# Altium schematic sheet 驰风队20200805.SchDoc
size A2
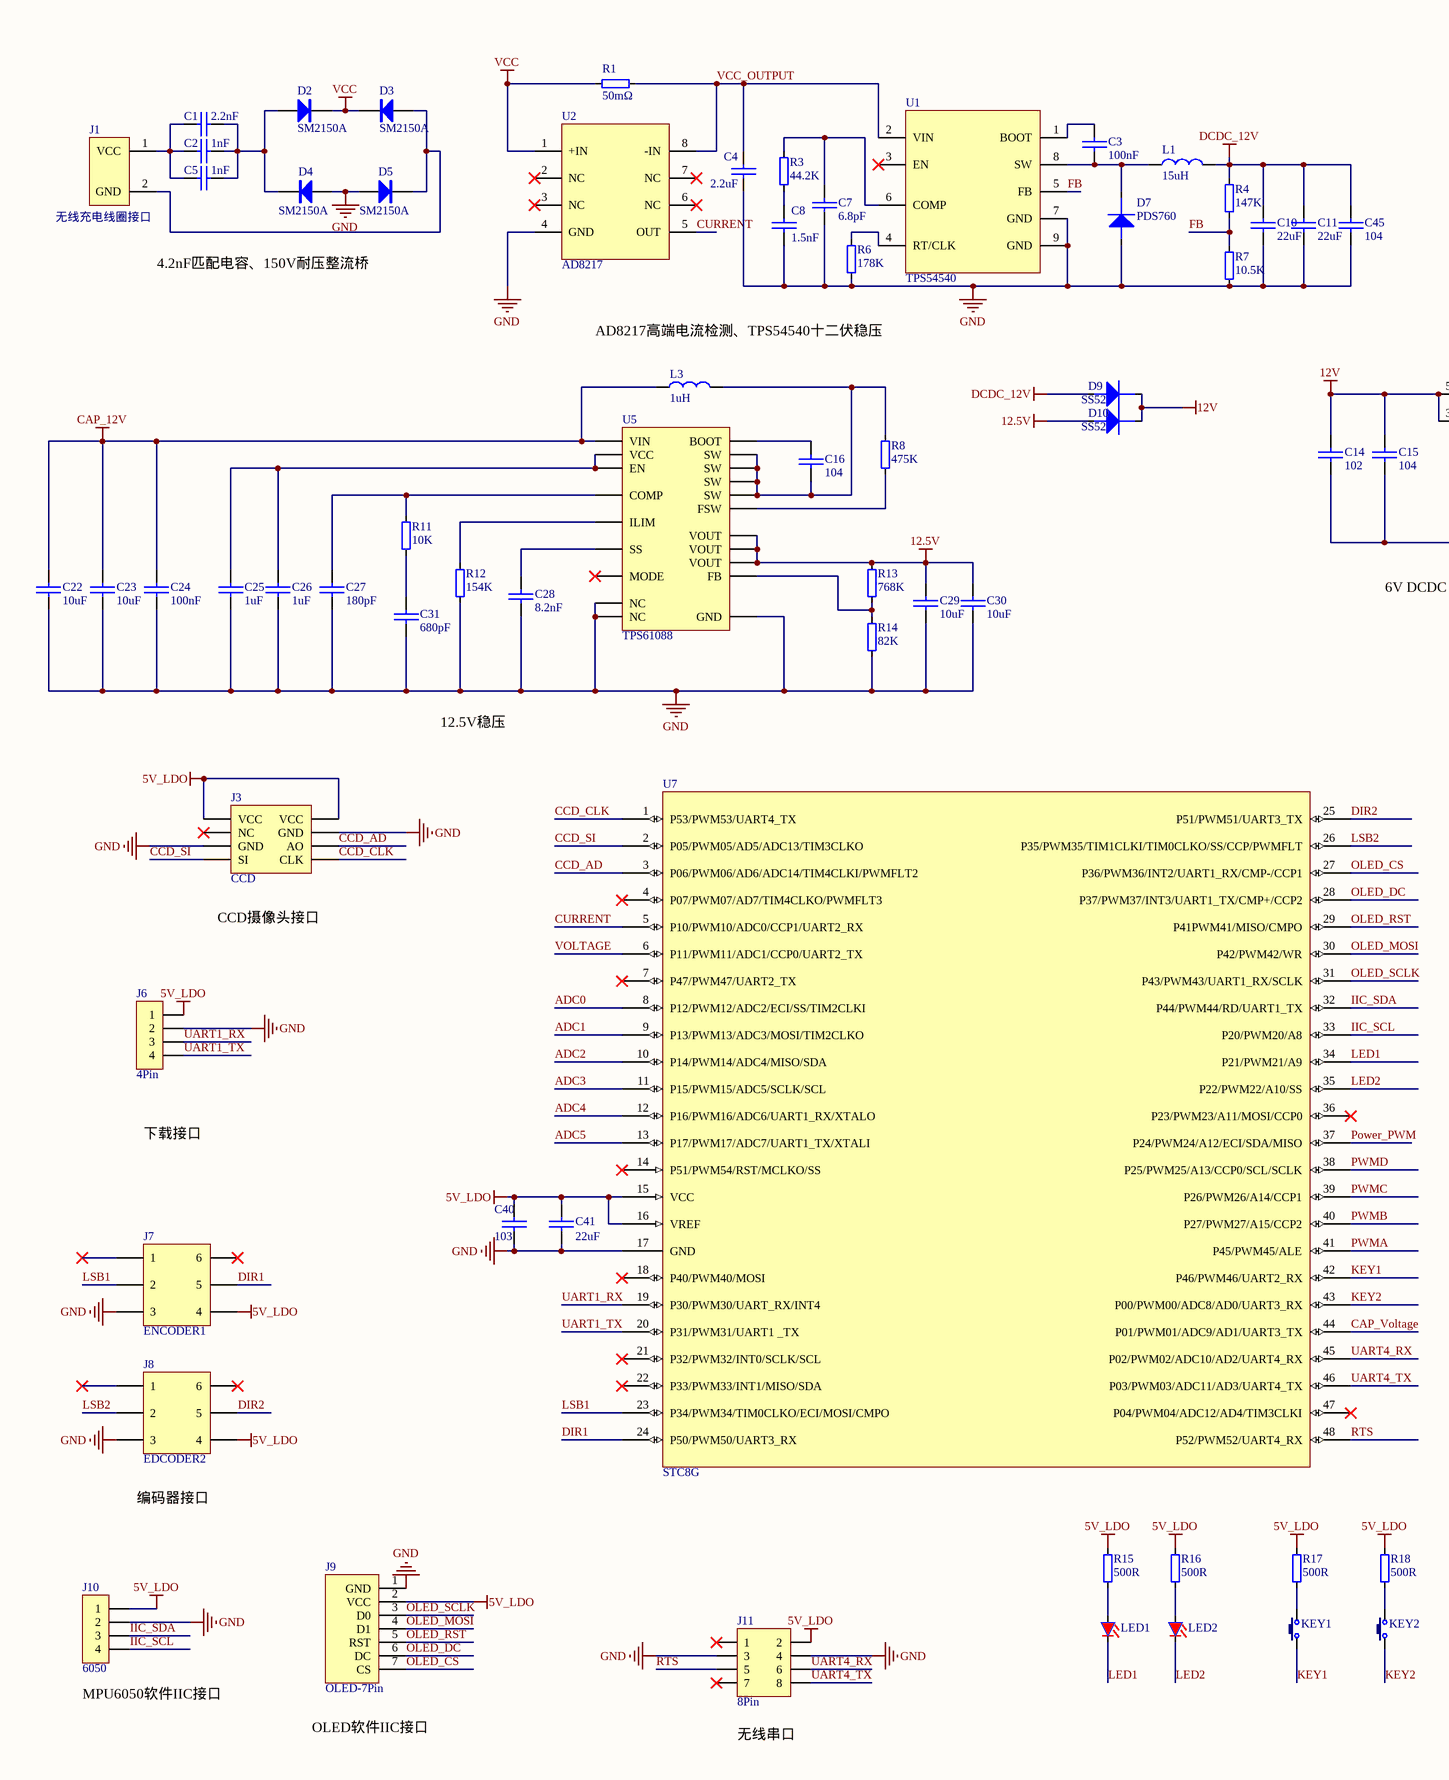
[diagram p0: 驰风队20200805.SchDoc, left]
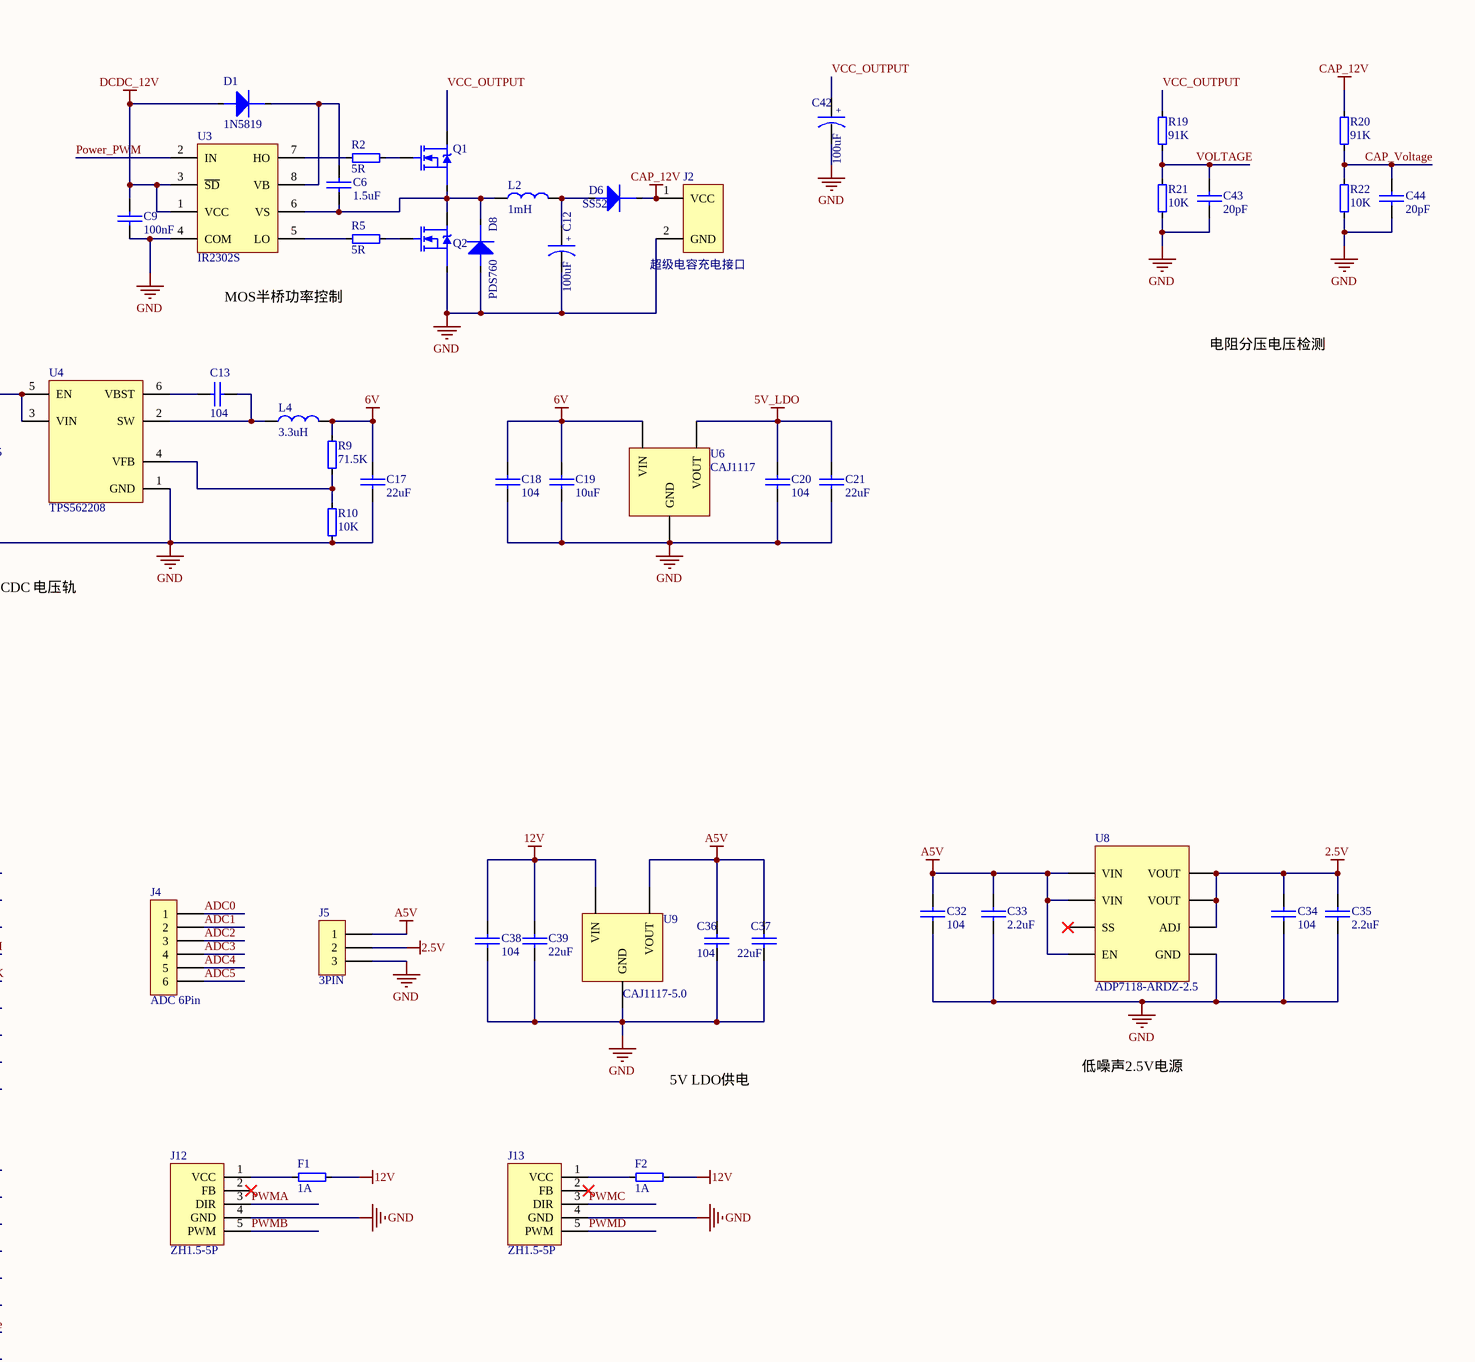
[diagram p1: 驰风队20200805.SchDoc, right]

## Parts
C1  2.2nF  [C1206]
C2  1nF  [C1206]
C3  100nF  [C0603]
C4  2.2uF  [C1206]
C5  1nF  [C1206]
C6  1.5uF  [C0603]
C7  6.8pF  [C0603]
C8  1.5nF  [C0603]
C9  100nF  [C0603]
C10  22uF  [C1206]
C11  22uF  [C1206]
C12  100uF  [CAP 8*9]
C13  104  [C0603]
C14  102  [C0603]
C15  104  [C0603]
C16  104  [C0603]
C17  22uF  [C1206]
C18  104  [C0603]
C19  10uF  [C0603]
C20  104  [C0603]
C21  22uF  [C1206]
C22  10uF  [C0603]
C23  10uF  [C0603]
C24  100nF  [C0603]
C25  1uF  [C0603]
C26  1uF  [C0603]
C27  180pF  [C0603]
C28  8.2nF  [C0603]
C29  10uF  [C0603]
C30  10uF  [C0603]
C31  680pF  [C0603]
C32  104  [C0603]
C33  2.2uF  [C0603]
C34  104  [C0603]
C35  2.2uF  [C0603]
C36  104  [C0603]
C37  22uF  [C1206]
C38  104  [C0603]
C39  22uF  [C1206]
C40  103  [C0603]
C41  22uF  [C1206]
C42  100uF  [CAP 8*9]
C43  20pF  [C0603]
C44  20pF  [C0603]
C45  104  [C0603]
D1  1N5819  [SOD123]
D2  SM2150A  [SMB]
D3  SM2150A  [SMB]
D4  SM2150A  [SMB]
D5  SM2150A  [SMB]
D6  SS52  [SMB]
D7  PDS760  [PDS760]
D8  PDS760  [PDS760]
D9  SS52  [SMB]
D10  SS52  [SMB]
F1  1A  [R0805]
F2  1A  [R0603]
J1  无线充电线圈接口  [2P]
J2  超级电容充电接口  [XT30]
J3  CCD  [8Pin]
J4  ADC 6Pin  [ADC 6Pin]
J5  3PIN  [3PIN]
J6  4Pin  [4Pin]
J7  ENCODER1  [DC3 2*3P]
J8  EDCODER2  [DC3 2*3P]
J9  OLED-7Pin  [OLED-7Pin]
J10  6050  [4Pin]
J11  8Pin  [8Pin]
J12  ZH1.5-5P  [ZH1.5-5P]
J13  ZH1.5-5P  [ZH1.5-5P]
KEY1  KEY  [KEY]  (value not drawn)
KEY2  KEY  [KEY]  (value not drawn)
L1  15uH  [L13.5*12.5]
L2  1mH  [L13.5*12.5]
L3  1uH  [L0630]
L4  3.3uH  [L0630]
LED1  LED  [LED]  (value not drawn)
LED2  LED  [LED]  (value not drawn)
Q1  PSMN3R7-100BSE  [D2PAK]  (value not drawn)
Q2  PSMN3R7-100BSE  [D2PAK]  (value not drawn)
R1  50mΩ  [R2010]
R2  5R  [R0603]
R3  44.2K  [R0603]
R4  147K  [R0603]
R5  5R  [R0603]
R6  178K  [R0603]
R7  10.5K  [R0603]
R8  475K  [R0603]
R9  71.5K  [R0603]
R10  10K  [R0603]
R11  10K  [R0603]
R12  154K  [R0603]
R13  768K  [R0603]
R14  82K  [R0603]
R15  500R  [R0603]
R16  500R  [R0603]
R17  500R  [R0603]
R18  500R  [R0603]
R19  91K  [R0603]
R20  91K  [R0603]
R21  10K  [R0603]
R22  10K  [R0603]
U1  TPS54540  [TPS54540]
U2  AD8217  [AD8217]
U3  IR2302S  [IR2302S]
U4  TPS562208  [TPS562208]
U5  TPS61088  [TPS61088]
U6  CAJ1117  [SOT-89]
U7  STC8G  [LQFP48]
U8  ADP7118-ARDZ-2.5  [SOP8]
U9  CAJ1117-5.0  [SOT-89]

## Nets
2.5V: C34.1 C35.1 J5.2 U8.1(VOUT) U8.2(VOUT) U8.3(ADJ)
5V_LDO: C20.2 C21.2 C40.1 C41.1 J3.1(VCC) J3.2(VCC) J6.1 J7.4 J8.4 J9.2(VCC) J10.1 J11.2 R15.2 R16.2 R17.2 R18.2 U6.2(VOUT) U7.15(VCC) U7.16(VREF)
6V: C17.1 C18.2 C19.2 L4.1 R9.2 U6.3(VIN)
12.5V: C29.1 C30.1 D10.1 R13.2 U5.14(VOUT) U5.15(VOUT) U5.16(VOUT)
12V: C14.1 C15.1 C38.2 C39.1 D9.2 D10.2 F1.2 F2.2 U4.3(VIN) U4.5(EN) U9.3(VIN)
A5V: C32.1 C33.1 C36.2 C37.1 J5.1 U8.5(EN) U8.7(VIN) U8.8(VIN) U9.2(VOUT)
CAP_12V: C22.2 C23.2 C24.2 D6.2 J2.1(VCC) L3.2 R20.2 U5.9(VIN)
DCDC_12V: C9.1 C10.1 C11.1 C45.1 D1.1 D9.1 L1.1 R4.2 U3.1(VCC) U3.3(~{SD})
GND: C4.2 C7.2 C8.2 C9.2 C10.2 C11.2 C12.2 C14.2 C15.2 C17.2 C18.1 C19.1 C20.1 C21.1 C22.1 C23.1 C24.1 C25.1 C26.1 C27.1 C28.1 C29.2 C30.2 C31.1 C32.2 C33.2 C34.2 C35.2 C36.1 C37.2 C38.1 C39.2 C40.2 C41.2 C42.2 C43.2 C44.2 C45.2 D4.1(A) D5.1(A) D7.1(A) D8.1(A) J2.2(GND) J3.4(GND) J3.5(GND) J5.3 J6.2 J7.3 J8.3 J9.1(GND) J10.2 J11.3 J11.4 J12.4(GND) J13.4(GND) Q2.3(S) R6.1 R7.1 R10.1 R12.1 R14.1 R21.1 R22.1 U1.7(GND) U1.9(GND) U2.4(GND) U3.4(COM) U4.1(GND) U5.11(NC) U5.12(NC) U5.20(GND) U6.1(GND) U7.17(GND) U8.4(GND) U9.1(GND)
VCC: D2.2(K) D3.2(K) R1.1 U2.1(+IN)
ADC0: J4.1 U7.8(P12/PWM12/ADC2/ECI/SS/TIM2CLKI)
ADC1: J4.2 U7.9(P13/PWM13/ADC3/MOSI/TIM2CLKO)
ADC2: J4.3 U7.10(P14/PWM14/ADC4/MISO/SDA)
ADC3: J4.4 U7.11(P15/PWM15/ADC5/SCLK/SCL)
ADC4: J4.5 U7.12(P16/PWM16/ADC6/UART1_RX/XTALO)
ADC5: J4.6 U7.13(P17/PWM17/ADC7/UART1_TX/XTALI)
CAP_Voltage: C44.1 R20.1 R22.2 U7.44(P01/PWM01/ADC9/AD1/UART3_TX)
CCD_AD: J3.6(AO) U7.3(P06/PWM06/AD6/ADC14/TIM4CLKI/PWMFLT2)
CCD_CLK: J3.8(CLK) U7.1(P53/PWM53/UART4_TX)
CCD_SI: J3.7(SI) U7.2(P05/PWM05/AD5/ADC13/TIM3CLKO)
CURRENT: U2.5(OUT) U7.5(P10/PWM10/ADC0/CCP1/UART2_RX)
DIR1: J7.5 U7.24(P50/PWM50/UART3_RX)
DIR2: J8.5 U7.25(P51/PWM51/UART3_TX)
FB: R4.1 R7.2 U1.5(FB)
IIC_SCL: J10.4 U7.33(P20/PWM20/A8)
IIC_SDA: J10.3 U7.32(P44/PWM44/RD/UART1_TX)
KEY1: KEY1.1 U7.42(P46/PWM46/UART2_RX)
KEY2: KEY2.1 U7.43(P00/PWM00/ADC8/AD0/UART3_RX)
LED1: LED1.2(k) U7.34(P21/PWM21/A9)
LED2: LED2.2(k) U7.35(P22/PWM22/A10/SS)
LSB1: J7.2 U7.23(P34/PWM34/TIM0CLKO/ECI/MOSI/CMPO)
LSB2: J8.2 U7.26(P35/PWM35/TIM1CLKI/TIM0CLKO/SS/CCP/PWMFLT)
OLED_CS: J9.7(CS) U7.27(P36/PWM36/INT2/UART1_RX/CMP-/CCP1)
OLED_DC: J9.6(DC) U7.28(P37/PWM37/INT3/UART1_TX/CMP+/CCP2)
OLED_MOSI: J9.4(D1) U7.30(P42/PWM42/WR)
OLED_RST: J9.5(RST) U7.29(P41PWM41/MISO/CMPO)
OLED_SCLK: J9.3(D0) U7.31(P43/PWM43/UART1_RX/SCLK)
Power_PWM: U3.2(IN) U7.37(P24/PWM24/A12/ECI/SDA/MISO)
PWMA: J12.3(DIR) U7.41(P45/PWM45/ALE)
PWMB: J12.5(PWM) U7.40(P27/PWM27/A15/CCP2)
PWMC: J13.3(DIR) U7.39(P26/PWM26/A14/CCP1)
PWMD: J13.5(PWM) U7.38(P25/PWM25/A13/CCP0/SCL/SCLK)
RTS: J11.5 U7.48(P52/PWM52/UART4_RX)
UART1_RX: J6.3 U7.19(P30/PWM30/UART_RX/INT4)
UART1_TX: J6.4 U7.20(P31/PWM31/UART1__TX)
UART4_RX: J11.6 U7.45(P02/PWM02/ADC10/AD2/UART4_RX)
UART4_TX: J11.8 U7.46(P03/PWM03/ADC11/AD3/UART4_TX)
VCC_OUTPUT: C4.1 C42.1 Q1.2(D) R1.2 R19.2 U1.2(VIN) U2.8(-IN)
VOLTAGE: C43.1 R19.1 R21.2 U7.6(P11/PWM11/ADC1/CCP0/UART2_TX)
NetC1_1: C1.1 C2.2 C5.2 D2.1(A) D4.2(K)
NetC1_2: C1.2 C2.1 C5.1 J1.1(VCC)
NetC3_1: C3.1 D7.2(K) L1.2 U1.8(SW)
NetC3_2: C3.2 U1.1(BOOT)
NetC6_1: C6.1 D1.2 U3.8(VB)
NetC6_2: C6.2 D8.2(K) L2.2 Q1.3(S) Q2.2(D) U3.6(VS)
NetC7_1: C7.1 R3.2 U1.6(COMP)
NetC8_1: C8.1 R3.1
NetC12_1: C12.1 D6.1 L2.1
NetC13_1: C13.1 U4.6(VBST)
NetC13_2: C13.2 L4.2 U4.2(SW)
NetC16_1: C16.1 U5.8(BOOT)
NetC16_2: C16.2 L3.1 R8.2 U5.4(SW) U5.5(SW) U5.6(SW) U5.7(SW)
NetC25_2: C25.2 C26.2 U5.1(VCC) U5.2(EN)
NetC27_2: C27.2 R11.2 U5.18(COMP)
NetC28_2: C28.2 U5.10(SS)
NetC31_2: C31.2 R11.1
NetD3_1: D3.1(A) D5.2(K) J1.2(GND)
NetF1_1: F1.1 J12.1(VCC)
NetF2_1: F2.1 J13.1(VCC)
NetKEY1_2: KEY1.2 R17.1
NetKEY2_2: KEY2.2 R18.1
NetLED1_1: LED1.1(a) R15.1
NetLED2_1: LED2.1(a) R16.1
NetQ1_1: Q1.1(G) R2.2
NetQ2_1: Q2.1(G) R5.2
NetR2_1: R2.1 U3.7(HO)
NetR5_1: R5.1 U3.5(LO)
NetR6_2: R6.2 U1.4(RT/CLK)
NetR8_1: R8.1 U5.3(FSW)
NetR9_1: R9.1 R10.2 U4.4(VFB)
NetR12_2: R12.2 U5.19(ILIM)
NetR13_1: R13.1 R14.2 U5.17(FB)

Not connected (* = marked no-connect by the designer): J3 3(NC)*; J7 1* 6*; J8 1* 6*; J11 1* 7*; J12 2(FB)*; J13 2(FB)*; U1 3(EN)*; U2 2(NC)* 3(NC)* 6(NC)* 7(NC)*; U5 13(MODE)*; U7 4(P07/PWM07/AD7/TIM4CLKO/PWMFLT3)* 7(P47/PWM47/UART2_TX)* 14(P51/PWM54/RST/MCLKO/SS)* 18(P40/PWM40/MOSI)* 21(P32/PWM32/INT0/SCLK/SCL)* 22(P33/PWM33/INT1/MISO/SDA)* 36(P23/PWM23/A11/MOSI/CCP0)* 47(P04/PWM04/ADC12/AD4/TIM3CLKI)*; U8 6(SS)*

## Notes on the sheet
- 4.2nF匹配电容、150V耐压整流桥
- (near L3) AD8217高端电流检测、TPS54540十二伏稳压
- MOS半桥功率控制
- 电阻分压电压检测
- 6V DCDC 电压轨
- 12.5V稳压
- (near J3) CCD摄像头接口
- 5V LDO供电
- 低噪声2.5V电源
- 下载接口
- (near J8) 编码器接口
- (near J10) MPU6050软件IIC接口
- (near J9) OLED软件IIC接口
- (near J11) 无线串口
- (in symbol BiCAP) +

## Library data of the parts
C1-C11 C13-C41 C43-C45 = MLCC
C12 C42 = BiCAP
D2-D5 = SM2150A: 肖特基二极管，150V耐压，2A工作电流
D6 D9 D10 = 1N5819
F1 F2 R1-R22 = RES
J1 J2 = 2P
J7 J8 = DC3 2*3P
J10 = 4Pin
L1-L4 = LEN
Q1 Q2 = PSMN3R7-100BSE: 100V耐压，3.5mΩ导通内阻
U8 = ADP7118-ARDZ
U9 = CAJ1117: 最大输入电压15V，最大工作电流1A